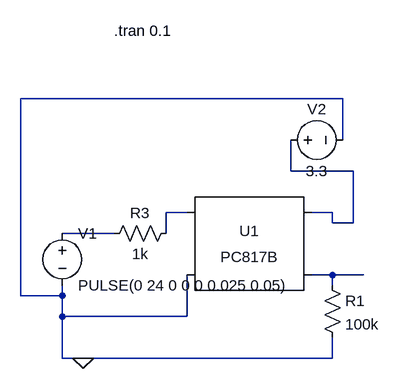
[diagram p0: schematic Optocoupler.asc]
Optocoupler.asc, the LTspice schematic file:
Version 4
SHEET 1 968 680
WIRE 576 32 80 32
WIRE 576 96 576 32
WIRE 496 144 496 96
WIRE 592 144 496 144
WIRE 336 208 304 208
WIRE 560 208 528 208
WIRE 560 224 560 208
WIRE 592 224 592 144
WIRE 592 224 560 224
WIRE 224 240 144 240
WIRE 304 240 304 208
WIRE 560 304 528 304
WIRE 608 304 560 304
WIRE 560 320 560 304
WIRE 80 336 80 32
WIRE 144 336 144 320
WIRE 144 336 80 336
WIRE 144 368 144 336
WIRE 336 368 336 304
WIRE 336 368 144 368
WIRE 144 432 144 368
WIRE 176 432 144 432
WIRE 560 432 560 400
WIRE 560 432 176 432
FLAG 176 432 0
SYMBOL voltage 480 96 R270
WINDOW 0 32 56 VTop 2
WINDOW 3 -32 56 VBottom 2
SYMATTR InstName V2
SYMATTR Value 3.3
SYMBOL res 320 224 R90
WINDOW 0 0 56 VBottom 2
WINDOW 3 32 56 VTop 2
SYMATTR InstName R3
SYMATTR Value 1k
SYMBOL Optos/PC817B 432 256 R0
SYMATTR InstName U1
SYMBOL voltage 144 224 R0
SYMATTR InstName V1
SYMATTR Value PULSE(0 24 0 0 0 0.025 0.05)
SYMBOL res 544 304 R0
SYMATTR InstName R1
SYMATTR Value 100k
TEXT 224 -72 Left 2 !.tran 0.1

The netlist it stands for:
* Optocoupler.asc
V2 N001 0 3.3
R3 N002 N003 1k
XU1 N002 0 N001 N004 PC817 Igain=1.5m
V1 N003 0 PULSE(0 24 0 0 0 0.025 0.05)
R1 N004 0 100k
.tran 0.1
.lib PC817.sub
.backanno
.end